# EAGLE design main_power (EAGLE 7.4.0)
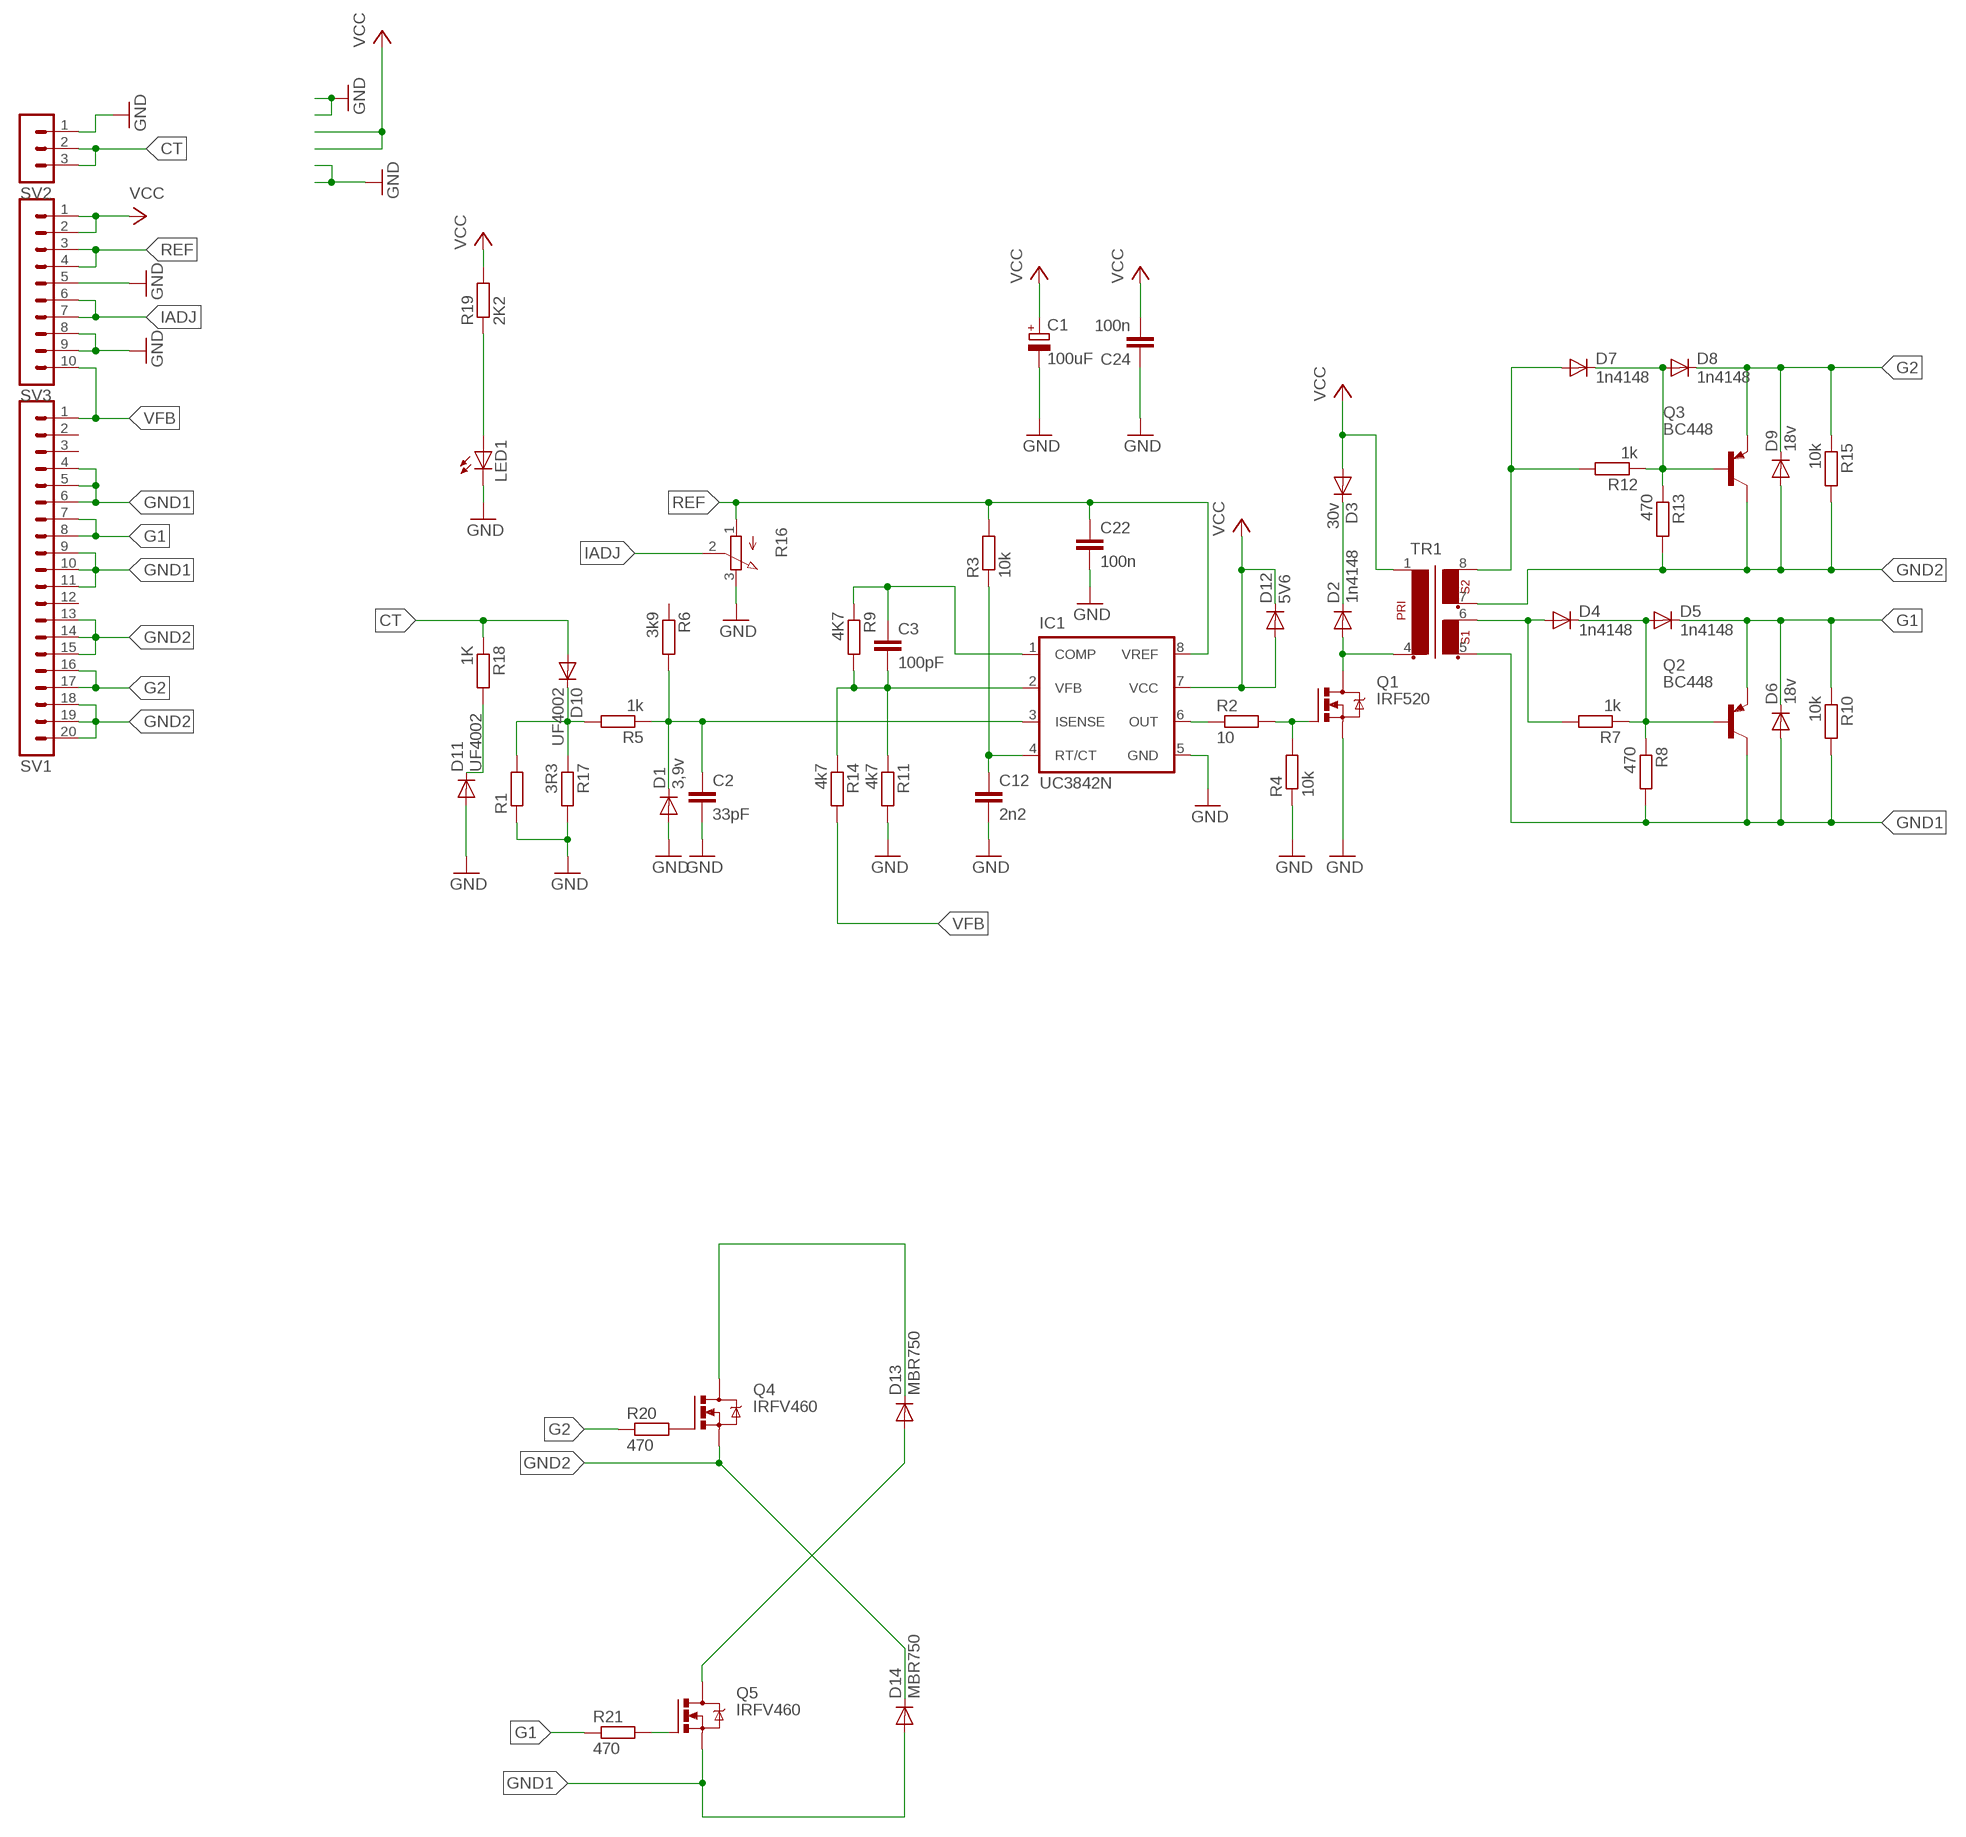
[diagram p0: schematic, sheet 1]

## Parts
C1  100uF  CPOL-EUE5-6  [E5-6]
C2  33pF  C-EU050-025X075  [C050-025X075]
C3  100pF  C-EU050-025X075  [C050-025X075]
C12  2n2  C-EU050-025X075  [C050-025X075]
C22  100n  C-EU050-025X075  [C050-025X075]
C24  100n  C-EU050-025X075  [C050-025X075]
D1  3,9v  1N4446  [DO35-10]
D2  1n4148  1N4446  [DO35-10]
D3  30v  1N4446  [DO35-10]
D4  1n4148  1N4446  [DO35-10]
D5  1n4148  1N4446  [DO35-10]
D6  18v  1N4446  [DO35-10]
D7  1n4148  1N4446  [DO35-10]
D8  1n4148  1N4446  [DO35-10]
D9  18v  1N4446  [DO35-10]
D10  UF4002  1N4446  [DO35-10]
D11  UF4002  1N4446  [DO35-10]
D12  5V6  1N4446  [DO35-10]
D13  MBR750  [TO220AC]
D14  MBR750  [TO220AC]
IC1  UC3842N  [DIL08]
LED1  LED5MM  [LED5MM]
Q1  IRF520  [TO220BV]
Q2  BC448  [TO92-EBC]
Q3  BC448  [TO92-EBC]
Q4  IRFV460  [TO258AA]
Q5  IRFV460  [TO258AA]
R1  R-EU_0411/12  [0411/12]
R2  10  R-EU_0207/10  [0207/10]
R3  10k  R-EU_0207/10  [0207/10]
R4  10k  R-EU_0207/10  [0207/10]
R5  1k  R-EU_0207/10  [0207/10]
R6  3k9  R-EU_0207/10  [0207/10]
R7  1k  R-EU_0207/10  [0207/10]
R8  470  R-EU_0207/10  [0207/10]
R9  4K7  R-EU_0207/10  [0207/10]
R10  10k  R-EU_0207/10  [0207/10]
R11  4k7  R-EU_0207/10  [0207/10]
R12  1k  R-EU_0207/10  [0207/10]
R13  470  R-EU_0207/10  [0207/10]
R14  4k7  R-EU_0207/10  [0207/10]
R15  10k  R-EU_0207/10  [0207/10]
R16  3RP/1610N  [3RP/1610N]
R17  3R3  R-EU_0207/10  [0207/10]
R18  1K  R-EU_0207/10  [0207/10]
R19  2K2  R-EU_0207/10  [0207/10]
R20  470  R-EU_0207/10  [0207/10]
R21  470  R-EU_0207/10  [0207/10]
SV1  MA20-1  [MA20-1]
SV2  MA03-1  [MA03-1]
SV3  MA10-1  [MA10-1]
TR1  EE20-2  [EE20-2]

## Nets
CT: D10.A R18.1 SV2.2 SV2.3
G1: D5.C D6.C Q2.E R10.1 R21.1 SV1.7 SV1.8
G2: D8.C D9.C Q3.E R15.1 R20.1 SV1.16 SV1.17
GND: C1.- C2.2 C12.2 C22.2 C24.1 D1.A D11.A IC1.5(GND) LED1.K(C) Q1.S R1.1 R4.1 R11.2 R16.3(E) R17.2 SV2.1 SV3.5 SV3.8 SV3.9
GND1: D6.A D14.A Q2.C Q5.2-S(S) R8.2 R10.2 SV1.4 SV1.5 SV1.6 SV1.9 SV1.10 SV1.11 TR1.5
GND2: D9.A D14.C Q3.C Q4.2-S(S) R13.2 R15.2 SV1.13 SV1.14 SV1.15 SV1.18 SV1.19 SV1.20 TR1.7
IADJ: R16.2(S) SV3.6 SV3.7
N$1: Q5.3-G(G) R21.2
N$2: C12.1 IC1.4(RT/CT) R3.1
N$3: IC1.6(OUT) R2.1
N$4: Q1.G R2.2 R4.2
N$5: C2.1 D1.C IC1.3(ISENSE) R5.1 R6.2
N$6: D2.A Q1.D TR1.4
N$7: Q4.3-G(G) R20.2
N$8: D2.C D3.C
N$9: LED1.A R19.1
N$10: C3.1 IC1.1(COMP) R9.1
N$11: D4.C D5.A Q2.B R7.1 R8.1
N$12: D4.A R7.2 TR1.6
N$13: D11.C R18.2
N$14: C3.2 IC1.2(VFB) R9.2 R11.1 R14.1
N$16: D13.C Q4.1-D(D)
N$17: D7.C D8.A Q3.B R12.1 R13.1
N$18: D7.A R12.2 TR1.8
N$19: D13.A Q5.1-D(D)
N$22: D10.C R1.2 R5.2 R17.1
REF: C22.1 IC1.8(VREF) R3.2 R16.1(A) SV3.3 SV3.4
VCC: C1.+ C24.2 D3.A D12.A D12.C IC1.7(VCC) R19.2 SV3.1 SV3.2 TR1.1
VFB: R14.2 SV1.1 SV3.10
Unconnected: R6.1 SV1.2 SV1.3 SV1.12

## Library data of the parts
C1 = rcl:CPOL-EU: POLARIZED CAPACITOR, European symbol
C2 C3 C12 C22 C24 = rcl:C-EU: CAPACITOR, European symbol
D1-D12 = diode:1N4446: DIODE high speed (Philips)
D13 D14 = diode:MBR750: DIODE barrier rectifier, 7.5 A, 50 V
IC1 = v-reg:UC384*: SMPS Controller Source: http://www.fairchildsemi.com/ds/UC/UC3843.pdf
LED1 = led:LED: LED OSRAM: - CHIPLED LG R971, LG N971, LY N971, LG Q971, LY Q971, LO R971, LY R971 LH N974, LH R974 LS Q976, LO Q976, LY Q976 LO Q996 - Hyper CHIPLED LW Q18S LB Q993, LB Q99A, LB R99A - SideLED LS A670, LO A670, LY A670, LG A670, LP A670 LB A673, LV A673, LT A673, LW A673 LH A674 LY A675 LS A676, LA A676, LO A676, LY A676, LW A676 LS A679, LY A679, LG A679 - Hyper Micro SIDELED® LS Y876, LA Y876, LO Y876, LY Y876 LT Y87S - SmartLED LW L88C, LW L88S LB L89C, LB L89S, LG L890 LS L89K, LO L89K, LY L89K LS L896, LA L896, LO L896, LY L896 - TOPLED LS T670, LO T670, LY T670, LG T670, LP T670 LSG T670, LSP T670, LSY T670, LOP T670, LYG T670 LG T671, LOG T671, LSG T671 LB T673, LV T673, LT T673, LW T673 LH T674 LS T676, LA T676, LO T676, LY T676, LB T676, LH T676, LSB T676, LW T676 LB T67C, LV T67C, LT T67C, LS T67K, LO T67K, LY T67K, LW E67C LS E67B, LA E67B, LO E67B, LY E67B, LB E67C, LV E67C, LT E67C LW T67C LS T679, LY T679, LG T679 LS T770, LO T770, LY T770, LG T770, LP T770 LB T773, LV T773, LT T773, LW T773 LH T774 LS E675, LA E675, LY E675, LS T675 LS T776, LA T776, LO T776, LY T776, LB T776 LHGB T686 LT T68C, LB T68C - Hyper Mini TOPLED® LB M676 - Mini TOPLED Santana® LG M470 LS M47K, LO M47K, LY M47K Source: http://www.osram.convergy.de LUXEON: - LUMILED® LXK2-PW12-R00, LXK2-PW12-S00, LXK2-PW14-U00, LXK2-PW14-V00 LXK2-PM12-R00, LXK2-PM12-S00, LXK2-PM14-U00 LXK2-PE12-Q00, LXK2-PE12-R00, LXK2-PE12-S00, LXK2-PE14-T00, LXK2-PE14-U00 LXK2-PB12-K00, LXK2-PB12-L00, LXK2-PB12-M00, LXK2-PB14-N00, LXK2-PB14-P00, LXK2-PB14-Q00 LXK2-PR12-L00, LXK2-PR12-M00, LXK2-PR14-Q00, LXK2-PR14-R00 LXK2-PD12-Q00, LXK2-PD12-R00, LXK2-PD12-S00 LXK2-PH12-R00, LXK2-PH12-S00 LXK2-PL12-P00, LXK2-PL12-Q00, LXK2-PL12-R00 Source: www.luxeon.com KINGBRIGHT: KA-3528ASYC Source: www.kingbright.com
Q1 = transistor-power:IRF520: HEXFET Power MOSFET
Q2 Q3 = transistor-pnp:BC448*: PNP Transistror
Q4 Q5 = transistor-power:IRFV460: HEXFET N-Channel Transistor
R1-R15 R17-R21 = rcl:R-EU_: RESISTOR, European symbol
R16 = pot:3RP/1610N: 16mm Potentiometer one level Source: http://www.alphapotentiometers.net/html/16mm_pot_2.html
SV1 = con-lstb:MA20-1: PIN HEADER; OC_FARNELL: unknown; OC_NEWARK: unknown
SV2 = con-lstb:MA03-1: PIN HEADER; OC_FARNELL: unknown; OC_NEWARK: unknown
SV3 = con-lstb:MA10-1: PIN HEADER; OC_FARNELL: unknown; OC_NEWARK: unknown
TR1 = trafo:EE20-2: TRANSFORMER 1 primary winding, 2 secondary windings ERA

## Board
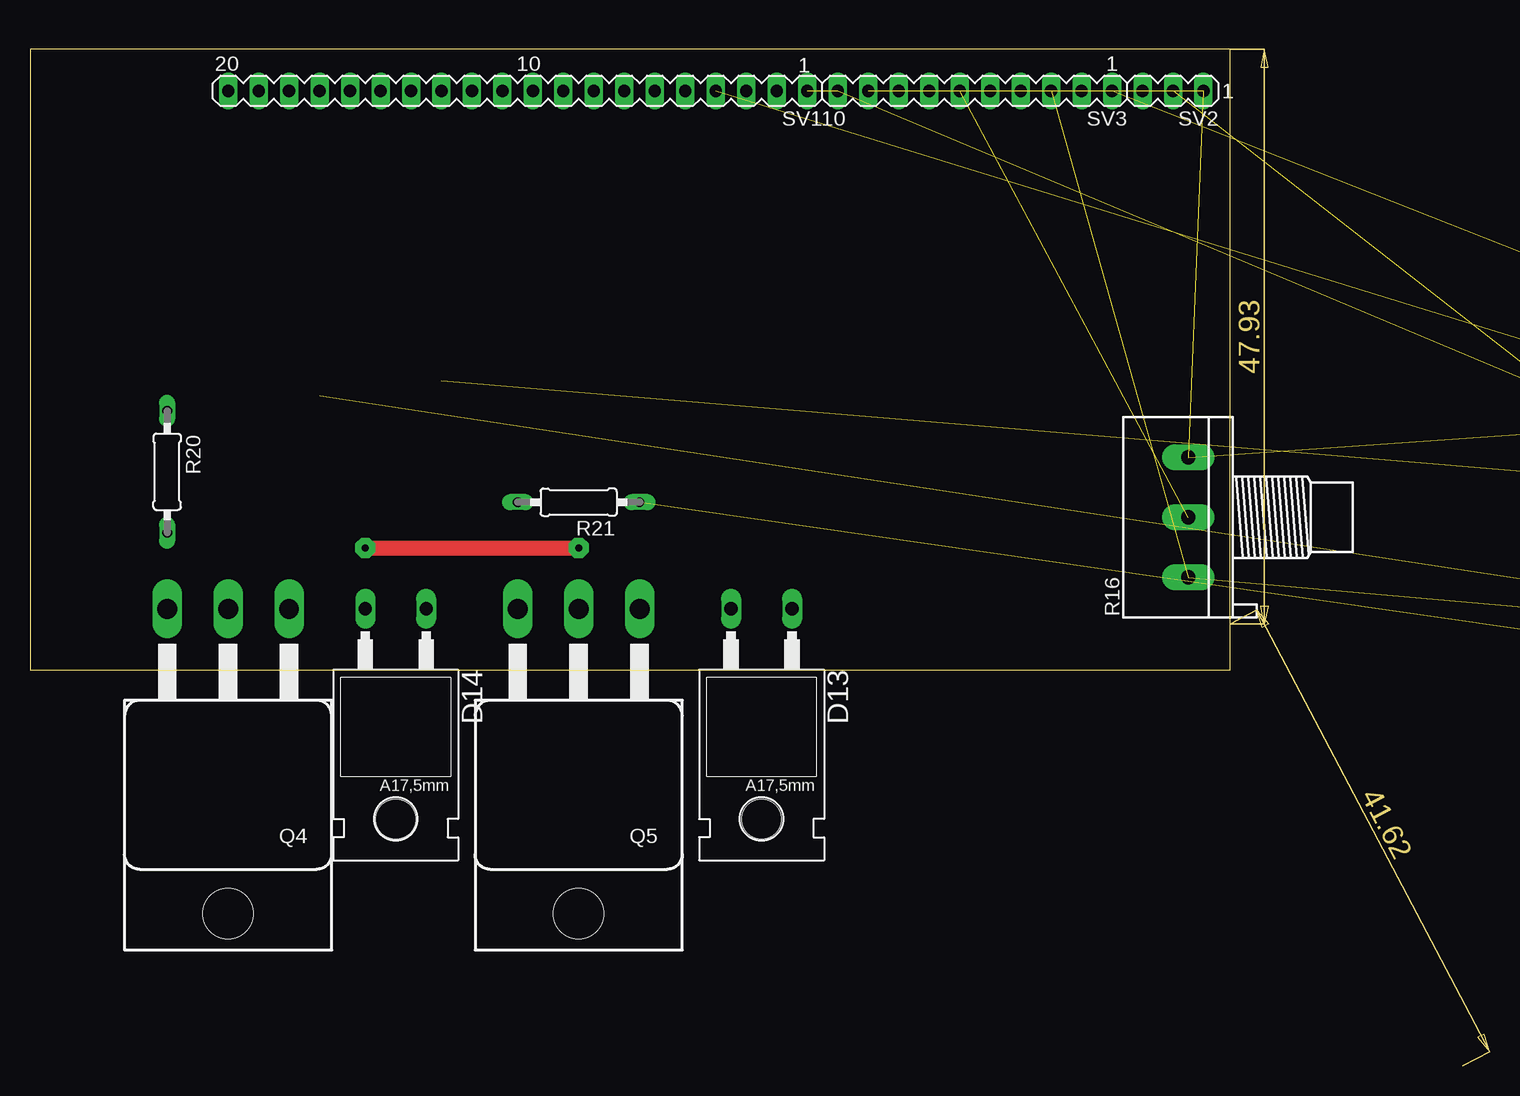
[diagram p1: board, top side]
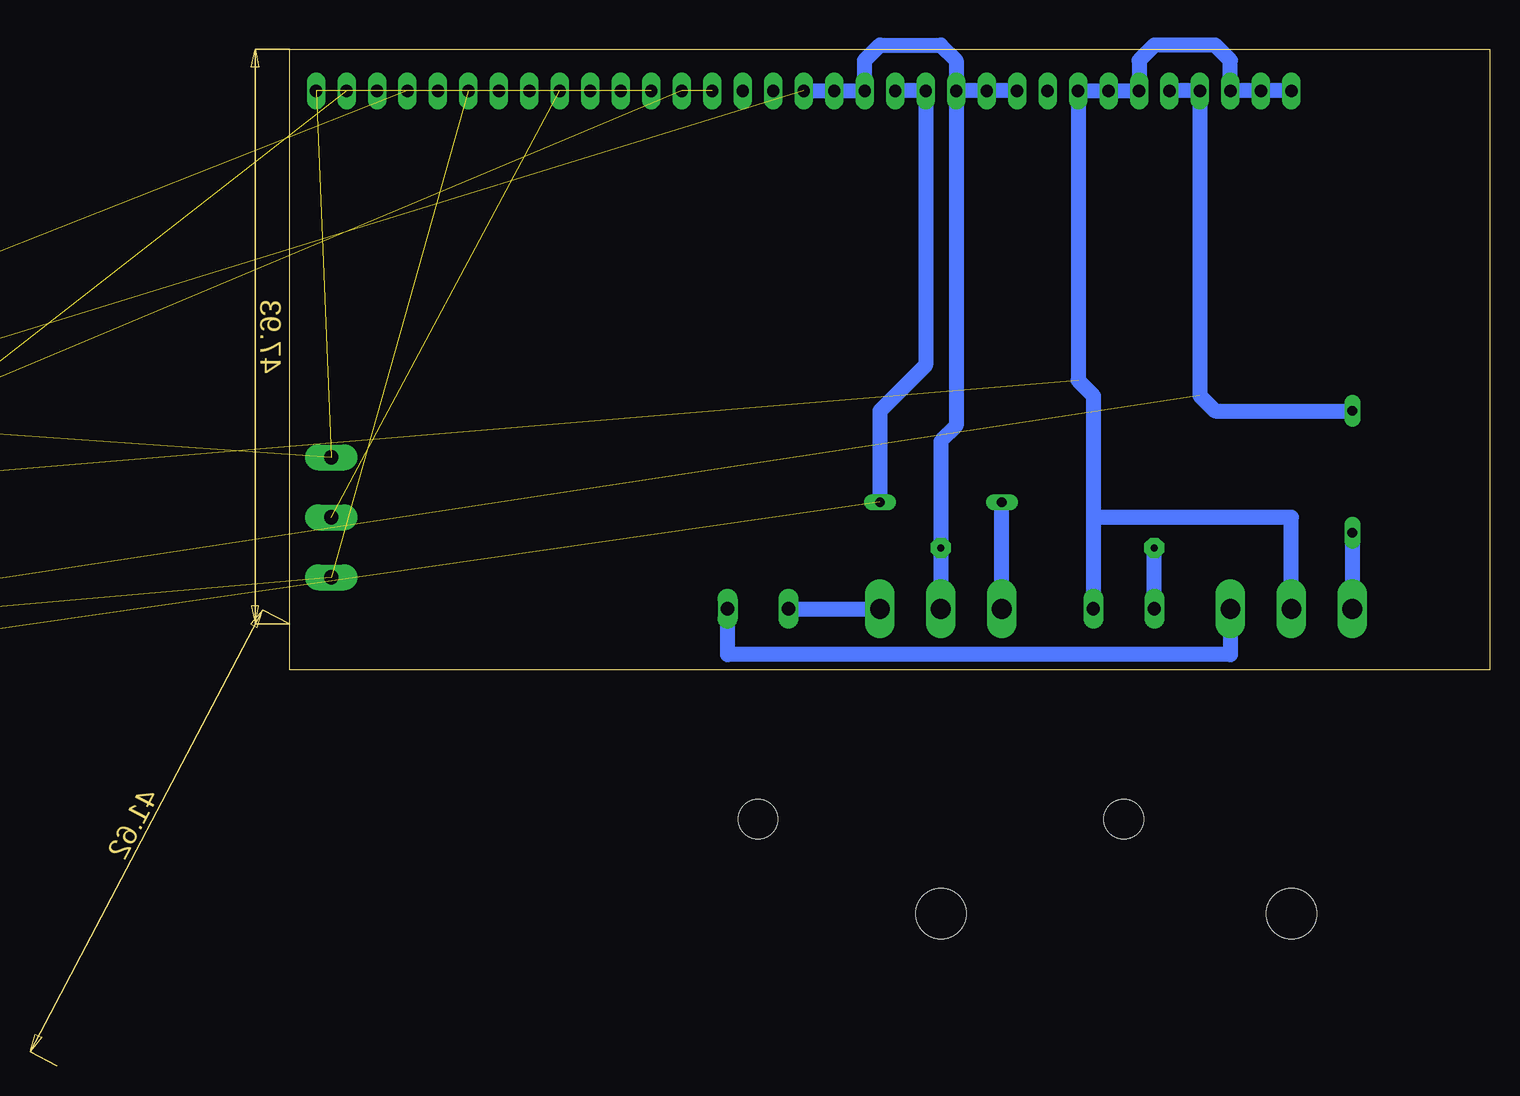
[diagram p2: board, bottom side, seen from below]

Size 100 x 51.74 mm. Coordinates in mm from the lower left corner, seen from the top.
Outline: 0,0 100,0 100,51.74 0,51.74 0,0
Copper layers (1*16): Top 0.035mm / dielectric 1.5mm / Bottom 0.035mm
Design rules "default": minimum track width 10mil, minimum drill 24mil, track to track 8mil, track to pad 8mil, pad to pad 8mil, via to via 8mil, smd to smd 8mil, copper to edge 40mil, drill to drill 8mil, minimum pad ring 10mil, minimum via ring 8mil, stop-mask expansion 4mil, vias tented up to drill 0mil, thermal gap 10mil

### Footprints (pad centres in the part's own frame; a part is rotated, then mirrored left to right if it is on the bottom)
E5-6 = drill 0.813 pad 1.905: + -2.54,0 | drill 0.813 pad 1.905 octagon: - 2.54,0
C050-025X075 = drill 0.813 long: 1 -2.54,0; 2 2.54,0
DO35-10 = drill 0.813 long: A 5.08,0; C -5.08,0
TO220AC = drill 1.118 long: A 2.54,-6.35; C -2.54,-6.35 | hole 3.302: 0,11.176
DIL08 = drill 0.813 long: 1 -3.81,-3.81; 2 -1.27,-3.81; 3 1.27,-3.81; 4 3.81,-3.81; 5 3.81,3.81; 6 1.27,3.81; 7 -1.27,3.81; 8 -3.81,3.81
LED5MM = drill 0.813 long: A -1.27,0; K 1.27,0
TO220BV = drill 1.016 long: D 0,-2.54; G -2.54,-2.54; S 2.54,-2.54
TO92-EBC = drill 0.813 long: B 0,-1.27; C -2.54,-1.27; E 2.54,-1.27
TO258AA = drill 1.651 long: 1-D -5.08,-25.4; 2-S 0,-25.4; 3-G 5.08,-25.4 | hole 4.191: 0,0
0411/12 = drill 0.914 long: 1 -6.35,0; 2 6.35,0
0207/10 = drill 0.813 long: 1 -5.08,0; 2 5.08,0
3RP/1610N = drill 1.2 pad 2.184 long: 1 -5,0; 2 0,0; 3 5,0
MA20-1 = drill 1.016 long: 1 -24.13,0; 2 -21.59,0; 3 -19.05,0; 4 -16.51,0; 5 -13.97,0; 6 -11.43,0; 7 -8.89,0; 8 -6.35,0; 9 -3.81,0; 10 -1.27,0; 11 1.27,0; 12 3.81,0; 13 6.35,0; 14 8.89,0; 15 11.43,0; 16 13.97,0; 17 16.51,0; 18 19.05,0; 19 21.59,0; 20 24.13,0
MA03-1 = drill 1.016 long: 1 -2.54,0; 2 0,0; 3 2.54,0
MA10-1 = drill 1.016 long: 1 -11.43,0; 2 -8.89,0; 3 -6.35,0; 4 -3.81,0; 5 -1.27,0; 6 1.27,0; 7 3.81,0; 8 6.35,0; 9 8.89,0; 10 11.43,0
EE20-2 = drill 1.016 long: 1 -7.493,7.493; 4 -7.493,-7.493; 5 7.493,-7.493; 6 7.493,-2.515; 7 7.493,2.515; 8 7.493,7.493

### Placement (x,y rotation side)
C1  172.72,1.27 180 top  (outside the outline)
C2  199.39,-7.62 0 top  (outside the outline)
C3  186.69,-2.54 0 top  (outside the outline)
C12  196.85,5.08 90 top  (outside the outline)
C22  186.69,15.24 90 top  (outside the outline)
C24  184.15,7.62 90 top  (outside the outline)
D1  198.12,-2.54 0 top  (outside the outline)
D2  209.55,19.05 180 top  (outside the outline)
D3  209.55,21.59 180 top  (outside the outline)
D4  219.71,-3.81 90 top  (outside the outline)
D5  212.09,-3.81 90 top  (outside the outline)
D6  209.55,-3.81 90 top  (outside the outline)
D7  242.57,-3.81 90 top  (outside the outline)
D8  234.95,-3.81 90 top  (outside the outline)
D9  232.41,-3.81 90 top  (outside the outline)
D10  175.26,-12.7 180 top  (outside the outline)
D11  175.26,-7.62 180 top  (outside the outline)
D12  189.23,17.78 270 top  (outside the outline)
D13  60.96,-1.27 180 top
D14  30.48,-1.27 180 top
IC1  190.5,6.35 0 top  (outside the outline)
LED1  171.45,22.86 180 top  (outside the outline)
Q1  201.93,19.05 270 top  (outside the outline)
Q2  219.71,-13.97 180 top  (outside the outline)
Q3  242.57,-13.97 180 top  (outside the outline)
Q4  16.51,-20.32 180 top
Q5  45.72,-20.32 180 top
R1  190.5,-12.7 180 top  (outside the outline)
R2  191.77,17.78 90 top  (outside the outline)
R3  189.23,0 180 top  (outside the outline)
R4  194.31,17.78 90 top  (outside the outline)
R5  189.23,-10.16 180 top  (outside the outline)
R6  189.23,-7.62 0 top  (outside the outline)
R7  217.17,-3.81 90 top  (outside the outline)
R8  222.25,-3.81 90 top  (outside the outline)
R9  180.34,2.54 270 top  (outside the outline)
R10  214.63,-3.81 90 top  (outside the outline)
R11  175.26,-5.08 180 top  (outside the outline)
R12  240.03,-3.81 90 top  (outside the outline)
R13  245.11,-3.81 90 top  (outside the outline)
R14  189.23,-5.08 0 top  (outside the outline)
R15  237.49,-3.81 90 top  (outside the outline)
R16  96.52,12.7 90 top
R17  189.23,-12.7 0 top  (outside the outline)
R18  175.26,-10.16 0 top  (outside the outline)
R19  180.34,17.78 270 top  (outside the outline)
R20  11.43,16.51 270 top
R21  45.72,13.97 180 top
SV1  40.64,48.26 180 top
SV2  95.25,48.26 180 top
SV3  78.74,48.26 180 top
TR1  227.33,15.24 270 top  (outside the outline)

### Tracks (layer width: path | path; a pad name or v marks a point on that pad's centre or on a via)
CT  (3 unrouted)
G1  (4 unrouted)
  Bottom 1.27: R21.1 50.8,21.59 46.99,25.4 SV1.8 SV1.7
G2  (4 unrouted)
  Bottom 1.27: R20.1 22.86,21.59 24.13,22.86 SV1.17 SV1.16
GND  (18 unrouted)
GND1  (via drill 0.6 pad 1.68)  (5 unrouted)
  Top 1.27: v27.94,10.16 v45.72,10.16
  Bottom 1.27: D14.A v27.94,10.16 | Q5.2-S v45.72,10.16 45.72,19.05 44.45,20.32 SV1.9 | SV1.11 SV1.10 SV1.9 | SV1.4 SV1.5 SV1.6 52.07,50.8 50.8,52.07 45.72,52.07 44.45,50.8 SV1.9
GND2  (5 unrouted)
  Bottom 1.27: Q4.2-S 16.51,12.7 33.02,12.7 | 33.02,12.7 D14.C | 33.02,12.7 33.02,22.86 34.29,24.13 SV1.13 SV1.14 SV1.15 29.21,50.8 27.94,52.07 22.86,52.07 21.59,50.8 SV1.18 SV1.19 SV1.20
IADJ  (2 unrouted)
N$1
  Bottom 1.27: Q5.3-G R21.2
N$2  (2 unrouted)
N$3  (1 unrouted)
N$4  (2 unrouted)
N$5  (4 unrouted)
N$6  (2 unrouted)
N$7
  Bottom 1.27: R20.2 Q4.3-G
N$8  (1 unrouted)
N$9  (1 unrouted)
N$10  (2 unrouted)
N$11  (4 unrouted)
N$12  (2 unrouted)
N$13  (1 unrouted)
N$14  (4 unrouted)
N$16
  Bottom 1.27: Q4.1-D 21.59,1.27 63.5,1.27 D13.C
N$17  (4 unrouted)
N$18  (2 unrouted)
N$19
  Bottom 1.27: D13.A Q5.1-D
N$22  (2 unrouted)
REF  (5 unrouted)
VCC  (9 unrouted)
VFB  (2 unrouted)